# EAGLE design activity_monitor_v3 (EAGLE 6.4)
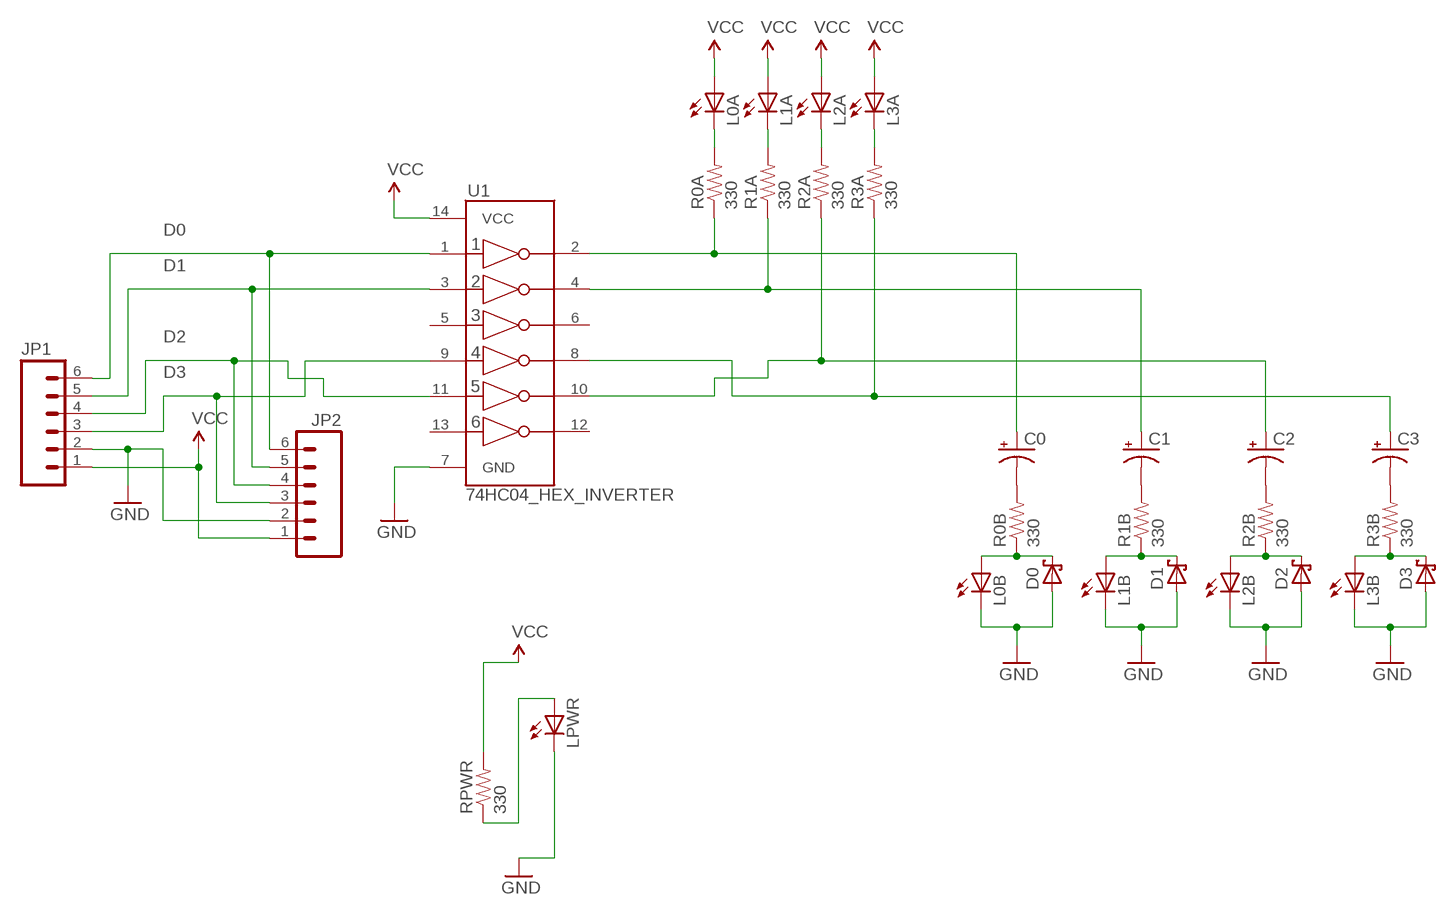
[diagram p0: schematic, sheet 1]

## Parts
C0  10UF-TANT  [EIA3216]
C1  10UF-TANT  [EIA3216]
C2  10UF-TANT  [EIA3216]
C3  10UF-TANT  [EIA3216]
D0  SCHOTTKY-DIODEDO35-7  [DO35-7]
D1  SCHOTTKY-DIODEDO35-7  [DO35-7]
D2  SCHOTTKY-DIODEDO35-7  [DO35-7]
D3  SCHOTTKY-DIODEDO35-7  [DO35-7]
JP1  M06SIP  [1X06]
JP2  M06SIP  [1X06]
L0A  LED0603  [LED-0603]
L0B  LED0603  [LED-0603]
L1A  LED0603  [LED-0603]
L1B  LED0603  [LED-0603]
L2A  LED0603  [LED-0603]
L2B  LED0603  [LED-0603]
L3A  LED0603  [LED-0603]
L3B  LED0603  [LED-0603]
LPWR  LED0603  [LED-0603]
R0A  330  RESISTOR0603-RES  [0603-RES]
R0B  330  RESISTOR0603-RES  [0603-RES]
R1A  330  RESISTOR0603-RES  [0603-RES]
R1B  330  RESISTOR0603-RES  [0603-RES]
R2A  330  RESISTOR0603-RES  [0603-RES]
R2B  330  RESISTOR0603-RES  [0603-RES]
R3A  330  RESISTOR0603-RES  [0603-RES]
R3B  330  RESISTOR0603-RES  [0603-RES]
RPWR  330  RESISTOR0603-RES  [0603-RES]
U1  74HC04_HEX_INVERTER  [DIL14]

## Nets
D0: JP1.6 JP2.6 U1.1(1A)
D1: JP1.5 JP2.5 U1.3(2A)
D2: JP1.4 JP2.4 U1.11(5A)
D3: JP1.3 JP2.3 U1.9(4A)
GND [power]: D0.A D1.A D2.A D3.A JP1.2 JP2.2 L0B.C L1B.C L2B.C L3B.C LPWR.C U1.7(GND)
N$1: C0.A(+) R0A.1 U1.2(1Y)
N$2: C1.A(+) R1A.1 U1.4(2Y)
N$3: C2.A(+) R2A.1 U1.10(5Y)
N$4: C3.A(+) R3A.1 U1.8(4Y)
N$5: L0A.C R0A.2
N$6: L1A.C R1A.2
N$7: L2A.C R2A.2
N$8: L3A.C R3A.2
N$9: C0.C(-) R0B.2
N$10: D0.C L0B.A R0B.1
N$12: C1.C(-) R1B.2
N$13: LPWR.A RPWR.1
N$15: C2.C(-) R2B.2
N$18: C3.C(-) R3B.2
R1B: D1.C L1B.A R1B.1
R2B: D2.C L2B.A R2B.1
R3B: D3.C L3B.A R3B.1
VCC [power]: JP1.1 JP2.1 L0A.A L1A.A L2A.A L3A.A RPWR.2 U1.14(VCC)
Unconnected: U1.5(3A) U1.6(3Y) U1.12(6Y) U1.13(6A)

## Library data of the parts
C0 C1-C3 = SparkFun-Capacitors:10UF-TANT: 10uF Tantalum SMT CAP-00811- 16V 10% (EIA-3216); PROD_ID: CAP-00811; VALUE: 10uF
D0 D1-D3 = diode:SCHOTTKY-DIODE: Schottky Diode
JP1 JP2 = SparkFun-Connectors:M06: Header 6 Standard 6-pin 0.1" header. Use with straight break away headers (SKU : PRT-00116), right angle break away headers (PRT-00553), swiss pins (PRT-00743), machine pins (PRT-00117), and female headers (PRT-00115). Molex polarized connector foot print use with SKU : PRT-08094 with associated crimp pins and housings. NOTES ON THE VARIANTS LOCK and LOCK_LONGPADS... This footprint was designed to help hold the alignment of a through-hole component (i.e. 6-pin header) while soldering it into place. You may notice that each hole has been shifted either up or down by 0.005 of an inch from it's more standard position (which is a perfectly straight line). This slight alteration caused the pins (the squares in the middle) to touch the edges of the holes. Because they are alternating, it causes a "brace" to hold the component in place. 0.005 has proven to be the perfect amount of "off-center" position when using our standard breakaway headers. Although looks a little odd when you look at the bare footprint, once you have a header in there, the alteration is very hard to notice. Also,if you push a header all the way into place, it is covered up entirely on the bottom side. This idea of altering the position of holes to aid alignment will be further integrated into the Sparkfun Library for other footprints. It can help hold any component with 3 or more connection pins.
L0A L0B L1A L1B L2A L2B L3A L3B LPWR = SparkFun-LED:LED: LEDs Standard schematic elements and footprints for 5mm, 3mm, 1206, and 0603 sized LEDs. 5mm - Spark Fun Electronics SKU : COM-00529 (and others)
R0A R0B R1A R1B R2A R2B R3A R3B RPWR = SparkFun-Passives:RESISTOR: Resistor Basic schematic elements and footprints for 0603, 1206, and PTH resistors.
U1 = SparkFun-DigitalIC:74HC04_HEX_INVERTER: 74HC04 Hex Inverter

## Net classes
0 default: width 0.254 mm, clearance 0.254 mm
1 power: width 0.508 mm, clearance 0.254 mm

## Board
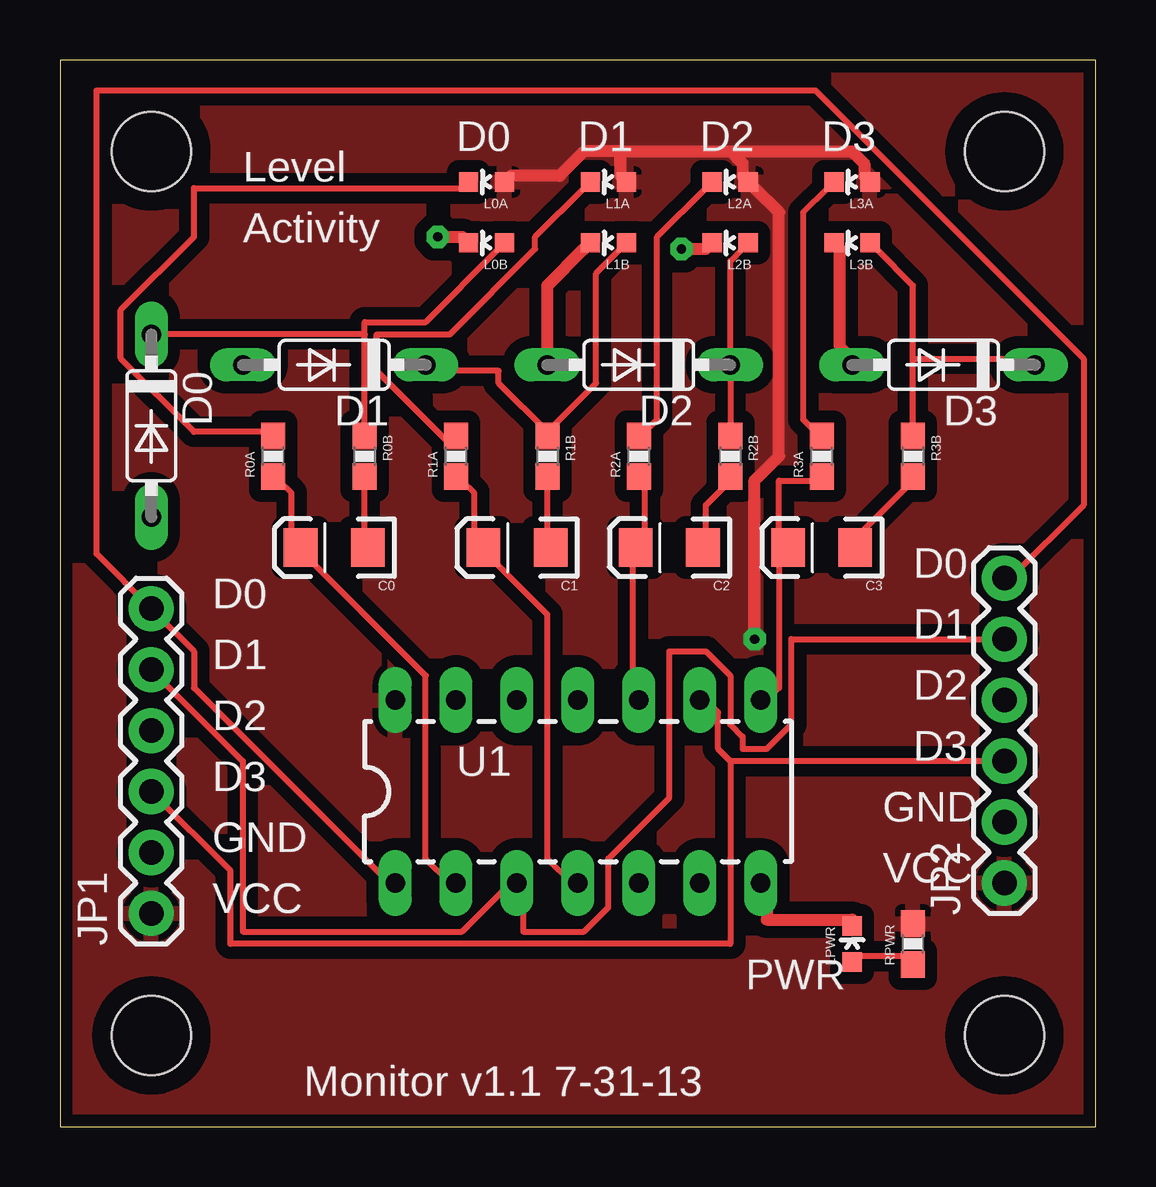
[diagram p1: board, top side]
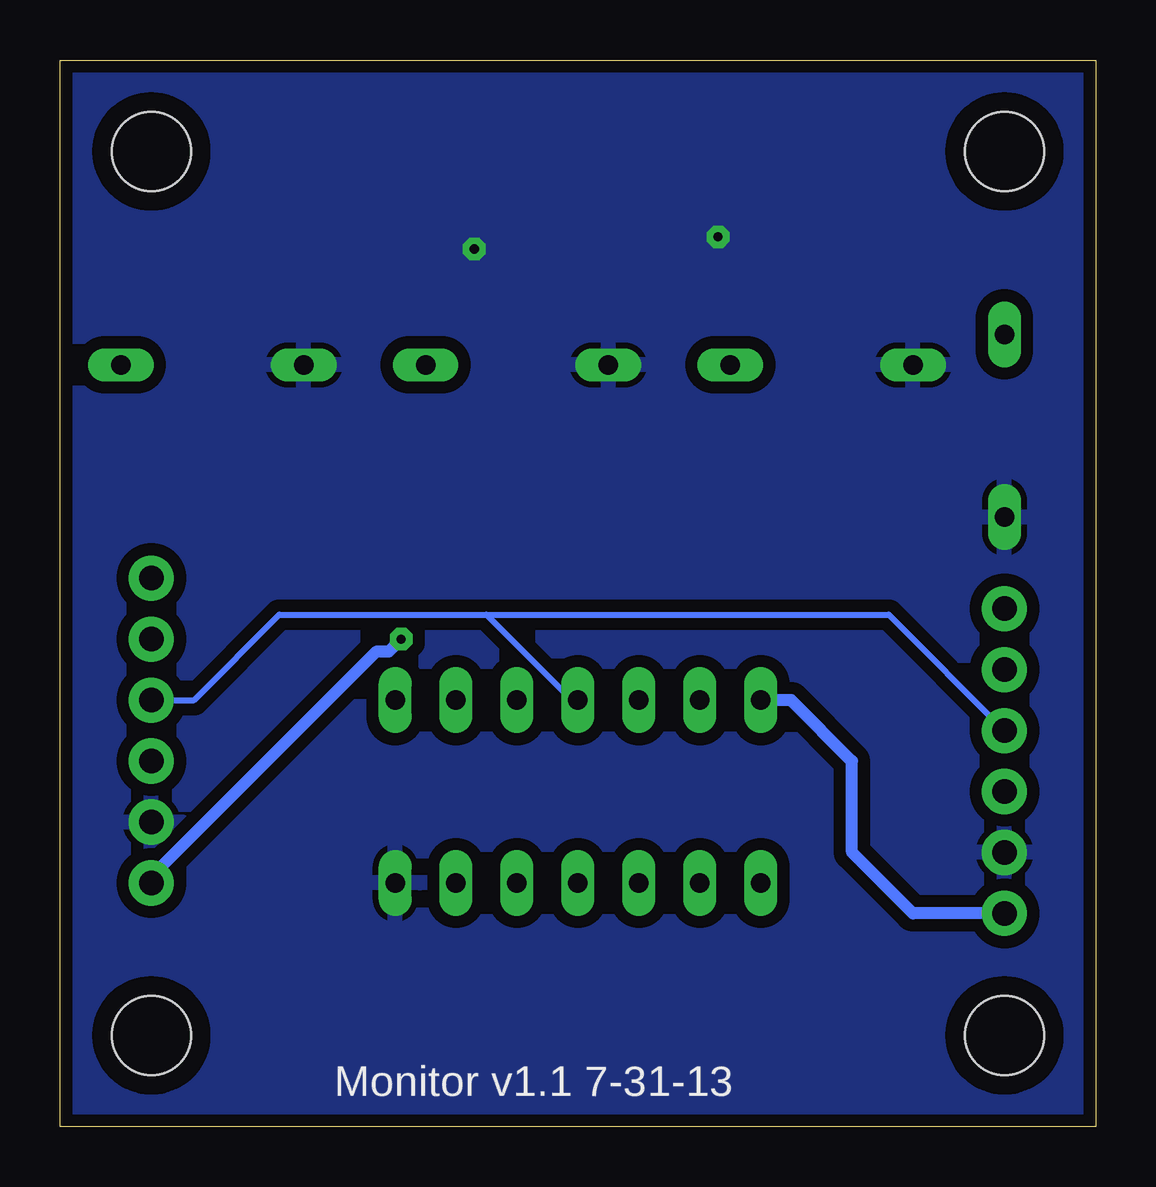
[diagram p2: board, bottom side, seen from below]

Size 43.18 x 44.45 mm. Coordinates in mm from the lower left corner, seen from the top.
Outline: 0,0 43.18,0 43.18,44.45 0,44.44 0,0
Copper layers (1*16): Top 0.0356mm / dielectric 1.5011mm / Bottom 0.0356mm
Design rules "mine": minimum track width 10mil, minimum drill 15mil, track to track 10mil, track to pad 10mil, pad to pad 10mil, via to via 10mil, smd to smd 10mil, copper to edge 15mil, drill to drill 10mil, minimum pad ring 11mil, minimum via ring 11mil, stop-mask expansion 4mil, vias tented up to drill 15mil, thermal gap 10mil

### Footprints (pad centres in the part's own frame; a part is rotated, then mirrored left to right if it is on the bottom)
EIA3216 = smd 1.4 x 1.6: A 1.4,0; C -1.4,0
DO35-7 = drill 0.813 long: A 3.81,0; C -3.81,0
1X06 = drill 1.016 pad 1.88: 1 0,0; 2 2.54,0; 3 5.08,0; 4 7.62,0; 5 10.16,0; 6 12.7,0
LED-0603 = smd 0.8 x 0.8: A 0,-0.75; C 0,0.75
0603-RES = smd 1.1 x 1: 1 -0.85,0; 2 0.85,0
DIL14 = drill 0.813 long: 1 -8.89,-3.81; 2 -6.35,-3.81; 3 -3.81,-3.81; 4 -1.27,-3.81; 5 1.27,-3.81; 6 3.81,-3.81; 7 6.35,-3.81; 8 6.35,3.81; 9 3.81,3.81; 10 1.27,3.81; 11 -1.27,3.81; 12 -3.81,3.81; 13 -6.35,3.81; 14 -8.89,3.81
STAND-OFF = hole 3.302: 0,0

### Placement (x,y rotation side)
C0  11.43,24.13 180 top
C1  19.05,24.13 180 top
C2  25.4,24.13 180 top
C3  31.75,24.13 180 top
D0  3.81,29.21 270 top
D1  11.43,31.75 180 top
D2  24.13,31.75 180 top
D3  36.83,31.75 180 top
JP1  3.81,8.89 90 top
JP2  39.37,10.16 90 top
L0A  17.78,39.37 90 top
L0B  17.78,36.83 90 top
L1A  22.86,39.37 90 top
L1B  22.86,36.83 90 top
L2A  27.94,39.37 90 top
L2B  27.94,36.83 90 top
L3A  33.02,39.37 90 top
L3B  33.02,36.83 90 top
LPWR  33.02,7.62 0 top
R0A  8.89,27.94 90 top
R0B  12.7,27.94 270 top
R1A  16.51,27.94 90 top
R1B  20.32,27.94 270 top
R2A  24.13,27.94 90 top
R2B  27.94,27.94 270 top
R3A  31.75,27.94 90 top
R3B  35.56,27.94 270 top
RPWR  35.56,7.62 90 top
U1  22.86,13.97 0 top
U$1  [STAND-OFF]  3.81,40.64 0 top
U$2  [STAND-OFF]  39.37,40.64 0 top
U$3  [STAND-OFF]  3.81,3.81 0 top
U$4  [STAND-OFF]  39.37,3.81 0 top

### Tracks (layer width: path | path; a pad name or v marks a point on that pad's centre or on a via)
D0
  Top 0.254: U1.1 13.72,10.16 5.59,18.29 5.59,19.81 JP1.6 1.52,23.88 1.52,43.18 31.5,43.18 42.67,32 42.67,25.91 39.62,22.86 JP2.6
D1
  Top 0.254: JP1.5 7.62,15.24 7.62,8.13 16.76,8.13 18.8,10.16 U1.3 19.3,10.16 19.3,8.13 21.84,8.13 22.86,9.14 22.86,11.18 25.4,13.72 25.4,19.81 26.92,19.81 27.94,18.8 27.94,16.76 28.45,16.26 28.45,15.75 29.46,15.75 30.48,16.76 30.48,20.32 JP2.5
D2
  Bottom 0.254: 25.4,21.34 21.84,17.78 U1.11 | 25.4,21.34 34.04,21.34 37.59,17.78 JP2.4 | JP1.4 8.64,21.34 25.4,21.34
D3
  Top 0.254: 27.94,15.24 27.43,15.75 27.43,17.27 26.92,17.78 U1.9 | JP2.3 27.94,15.24 | JP1.3 7.11,10.67 7.11,7.62 27.94,7.62 27.94,15.24
GND  (via drill 0.38)
  Top 0.508: v15.75,37.08 16.76,37.08 L0B.C | D2.A 20.32,35.05 21.84,36.58 L1B.C | v25.91,36.58 26.92,36.58 L2B.C | L3B.C 32.51,36.58 32.51,32.51 33.02,32 D3.A | LPWR.C 33.02,8.64 29.46,8.64 29.46,10.16 U1.7
  pour Bottom (isolate 0.508): 0,44.45 43.18,44.45 43.18,0 0,0
N$1
  Top 0.254: R0A.1 9.14,26.92 9.65,26.42 9.65,24.38 C0.A 10.16,23.88 15.24,18.8 15.24,11.18 16.26,10.16 U1.2
N$2
  Top 0.254: R1A.1 16.76,26.92 17.27,26.42 17.27,24.38 C1.A 17.78,23.88 20.32,21.34 20.32,11.18 21.34,10.16 U1.4
N$3
  Top 0.254: R2A.1 24.38,26.92 24.38,24.38 C2.A 23.88,23.88 23.88,17.78 U1.10
N$4
  Top 0.254: R3A.1 31.5,26.92 29.97,26.92 29.97,24.38 C3.A 29.97,23.88 29.97,18.29 29.46,17.78 U1.8
N$5
  Top 0.254: L0A.C 16.76,39.12 5.59,39.12 5.59,37.08 2.54,34.04 2.54,32 5.59,28.96 8.64,28.96 R0A.2
N$6
  Top 0.254: L1A.C 21.84,39.12 19.81,37.08 19.81,36.58 16.26,33.02 13.21,33.02 13.21,31.5 16.26,28.45 R1A.2
N$7
  Top 0.254: L2A.C 26.92,39.12 24.89,37.08 24.89,29.46 24.38,28.96 R2A.2
N$8
  Top 0.254: L3A.C 32,39.12 30.99,38.1 30.99,29.46 31.5,28.96 R3A.2
N$9
  Top 0.254: R0B.2 12.7,24.38 C0.C
N$10
  Top 0.254: R0B.1 12.7,33.02 | 12.7,33.02 12.7,33.53 15.24,33.53 18.29,36.58 L0B.A | 12.7,33.02 D0.C
N$12
  Top 0.254: R1B.2 20.32,24.38 C1.C
N$13
  Top 0.254: LPWR.A 33.02,7.11 35.56,7.11 RPWR.1
N$15
  Top 0.254: R2B.2 27.94,26.92 26.92,25.91 26.92,24.38 C2.C
N$18
  Top 0.254: R3B.2 35.56,26.92 33.53,24.89 33.53,24.38 C3.C
R1B
  Top 0.254: 20.32,28.96 22.35,30.99 22.35,35.56 23.37,36.58 L1B.A | 20.32,28.96 18.29,30.99 18.29,31.5 15.24,31.5 D1.C | 20.32,28.96 R1B.1
R2B
  Top 0.254: L2B.A 28.45,36.58 27.94,36.07 D2.C R2B.1
R3B
  Top 0.254: R3B.1 35.56,32 | 35.56,32 35.56,35.05 34.04,36.58 L3B.A | 35.56,32 40.64,32 D3.C
VCC  (via drill 0.38)
  Top 0.508: 23.37,40.64 21.84,40.64 20.83,39.62 18.8,39.62 L0A.A | 23.37,40.64 23.37,39.62 L1A.A | 27.94,40.64 28.45,40.13 28.45,39.62 L2A.A 28.96,39.12 29.97,38.1 29.97,27.94 28.96,26.92 v28.96,20.32 | 23.37,40.64 27.94,40.64 | 27.94,40.64 33.02,40.64 33.53,40.13 33.53,39.62 L3A.A
  Bottom 0.508: JP1.1 7.62,8.89 10.16,11.43 10.16,15.24 12.7,17.78 U1.14 | v28.96,20.32 29.46,19.81 29.97,19.81 39.62,10.16 JP2.1
  pour Top (isolate 0.508): 0,44.45 43.18,44.45 43.18,0 0,0

### Text on the board
tPlace: D0 | D1 | D2 | D3 | Level | Activity | D0 | D0 | D1 | D1 | D2 | D2 | D3 | D3 | GND | GND | VCC | VCC | PWR | Monitor v1.1 7-31-13
bPlace: Monitor v1.1 7-31-13